# Altium schematic sheet LM5177_PINOUT.SchDoc
size C; SheetNumber: 16; SheetTotal: 19
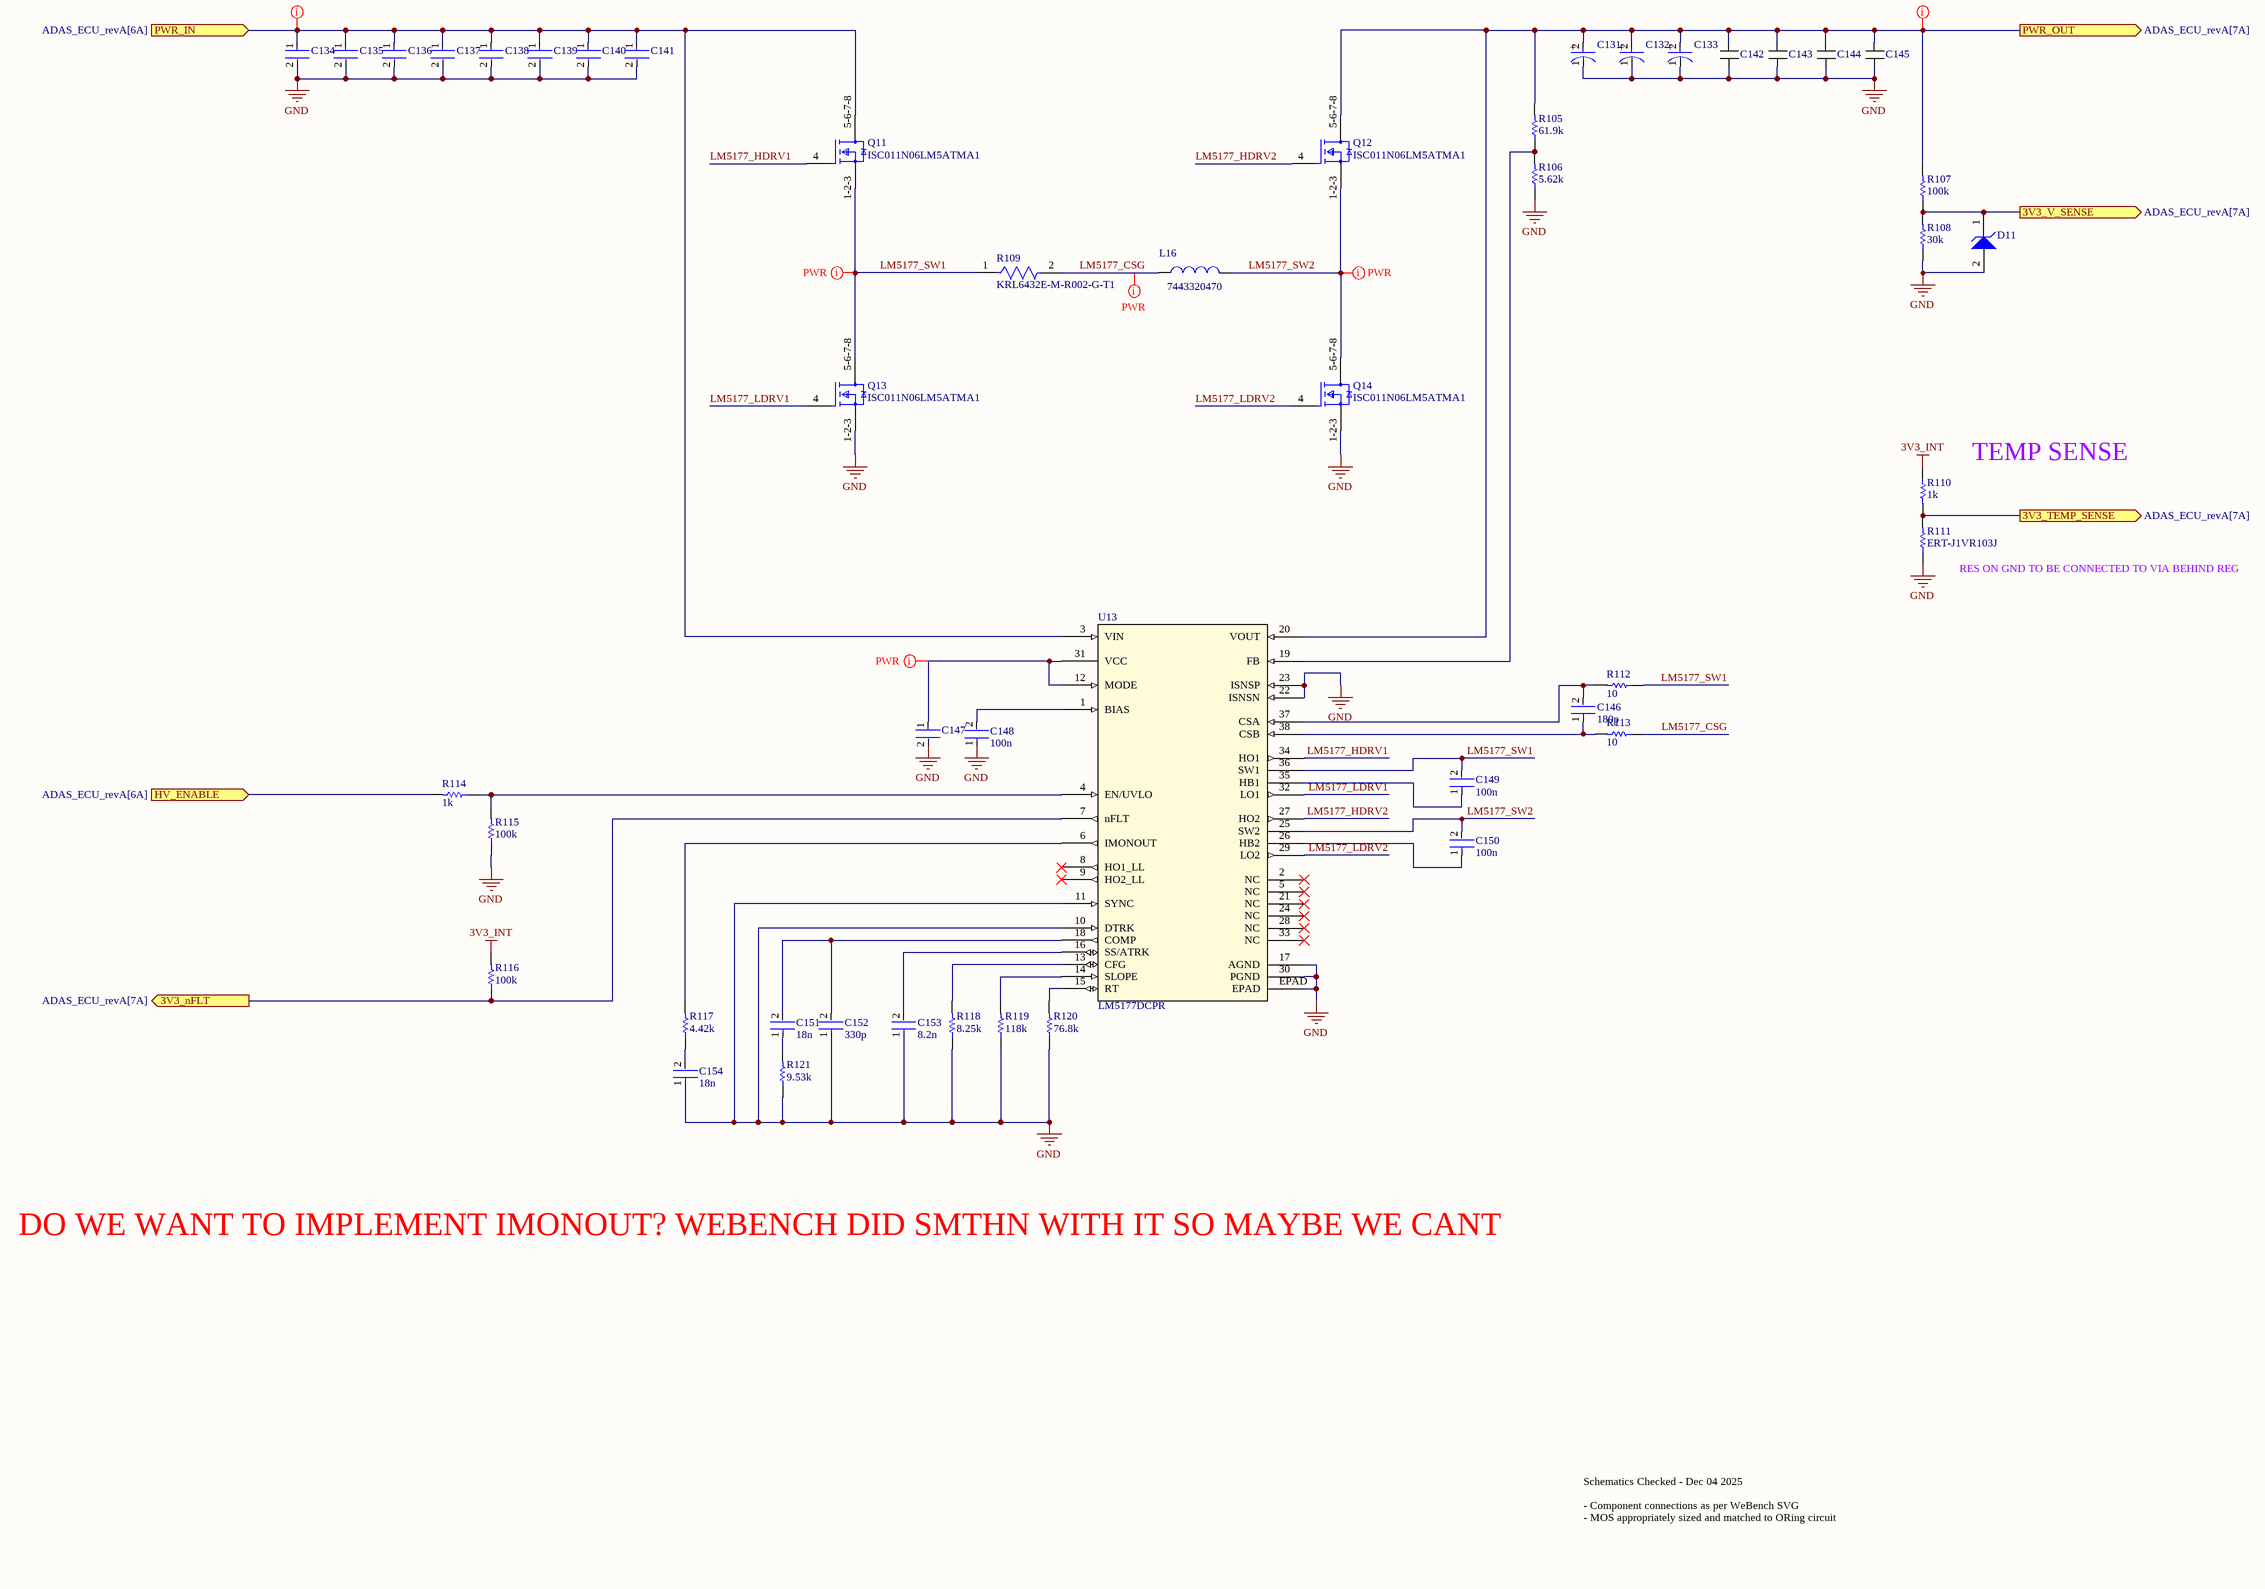
[diagram p0: LM5177_PINOUT.SchDoc]

## Parts
C131  20SVPF120M  [FP-OS-CON-SMT-C6-MFG]  (value not drawn)
C132  20SVPF120M  [FP-OS-CON-SMT-C6-MFG]  (value not drawn)
C133  20SVPF120M  [FP-OS-CON-SMT-C6-MFG]  (value not drawn)
C134  C3225X7R1H106M250AC  [FP-C3225-250-0_4-MFG]  (value not drawn)
C135  C3225X7R1H106M250AC  [FP-C3225-250-0_4-MFG]  (value not drawn)
C136  C3225X7R1H106M250AC  [FP-C3225-250-0_4-MFG]  (value not drawn)
C137  C3225X7R1H106M250AC  [FP-C3225-250-0_4-MFG]  (value not drawn)
C138  C3225X7R1H106M250AC  [FP-C3225-250-0_4-MFG]  (value not drawn)
C139  C3225X7R1H106M250AC  [FP-C3225-250-0_4-MFG]  (value not drawn)
C140  C3225X7R1H106M250AC  [FP-C3225-250-0_4-MFG]  (value not drawn)
C141  C3225X7R1H106M250AC  [FP-C3225-250-0_4-MFG]  (value not drawn)
C142  CGA9P2X7R1E226M250KA  [CGA9P2X7R1E226M250KA-Footprint-1]  (value not drawn)
C143  CGA9P2X7R1E226M250KA  [CGA9P2X7R1E226M250KA-Footprint-1]  (value not drawn)
C144  CGA9P2X7R1E226M250KA  [CGA9P2X7R1E226M250KA-Footprint-1]  (value not drawn)
C145  CGA9P2X7R1E226M250KA  [CGA9P2X7R1E226M250KA-Footprint-1]  (value not drawn)
C146  180p  [FP-0402-L_1_0_0_05-W_0_5-IPC_A]
C147  GRM188R60J226MEA0D  [FP-GRM188-0_1-e0_2_0_5-MFG]  (value not drawn)
C148  100n  [FP-0402-L_1_0_0_05-W_0_5-IPC_A]
C149  100n  [FP-0402-L_1_0_0_05-W_0_5-IPC_A]
C150  100n  [FP-0402-L_1_0_0_05-W_0_5-IPC_A]
C151  18n  [FP-0402-L_1_0_0_05-W_0_5-IPC_A]
C152  330p  [FP-0402-L_1_0_0_05-W_0_5-IPC_A]
C153  8.2n  [FP-0402-L_1_0_0_05-W_0_5-IPC_A]
C154  18n  [FP-0402-L_1_0_0_05-W_0_5-IPC_A]
D11  MM5Z3V3T1G  [ONSC-SOD-523-2-502-01_V]  (value not drawn)
L16  7443320470  [WE-HCC_1210]
Q11  ISC011N06LM5ATMA1  [FP-PG-TDSON-8-MFG]
Q12  ISC011N06LM5ATMA1  [FP-PG-TDSON-8-MFG]
Q13  ISC011N06LM5ATMA1  [FP-PG-TDSON-8-MFG]
Q14  ISC011N06LM5ATMA1  [FP-PG-TDSON-8-MFG]
R105  61.9k  [R0603B]
R106  5.62k  [R0603B]
R107  100k  [R0603B]
R108  30k  [R0603B]
R109  KRL6432E-M-R002-G-T1  [FP-KRL6432E-MFG]
R110  1k  [R0603B]
R111  ERT-J1VR103J  [RESC1608X90X30ML15T20]
R112  10  [R0603B]
R113  10  [R0603B]
R114  1k  [R0603B]
R115  100k  [R0603B]
R116  100k  [R0603B]
R117  4.42k  [R0603B]
R118  8.25k  [R0603B]
R119  118k  [R0603B]
R120  76.8k  [R0603B]
R121  9.53k  [R0603B]
U13  LM5177DCPR  [LM5177DCPR-Footprint-1]

## Ports
3V3_nFLT (out, see ADAS_ECU_revA[7A]), 3V3_TEMP_SENSE (out, see ADAS_ECU_revA[7A]), 3V3_V_SENSE (out, see ADAS_ECU_revA[7A]), HV_ENABLE (in, see ADAS_ECU_revA[6A]), PWR_IN (in, see ADAS_ECU_revA[6A]), PWR_OUT (out, see ADAS_ECU_revA[7A])

## Nets
3V3_INT: R110.1 R116.2
GND: C131.1(C) C132.1(C) C133.1(C) C134.2 C135.2 C136.2 C137.2 C138.2 C139.2 C140.2 C141.2 C142.2 C143.2 C144.2 C145.2 C147.2 C148.1 C152.1 C153.1 C154.1 D11.2(A) Q13.1-2-3(S) Q14.1-2-3(S) R106.1 R108.1 R111.1 R115.1 R118.1 R119.1 R120.1 R121.1 U13.10(DTRK) U13.11(SYNC) U13.17(AGND) U13.22(ISNSN) U13.23(ISNSP) U13.30(PGND) U13.EPAD
3V3_nFLT: R116.1 U13.7(nFLT) ; port 3V3_nFLT
3V3_TEMP_SENSE: R110.2 R111.2 ; port 3V3_TEMP_SENSE
3V3_V_SENSE: D11.1(K) R107.1 R108.2 ; port 3V3_V_SENSE
HV_ENABLE: R114.2 ; port HV_ENABLE
LM5177_CSG: L16.1 R109.2 R113.1
LM5177_HDRV1: Q11.4(G) U13.34(HO1)
LM5177_HDRV2: Q12.4(G) U13.27(HO2)
LM5177_LDRV1: Q13.4(G) U13.32(LO1)
LM5177_LDRV2: Q14.4(G) U13.29(LO2)
LM5177_SW1: C149.2 Q11.1-2-3(S) Q13.5-6-7-8(D) R109.1 R112.1 U13.36(SW1)
LM5177_SW2: C150.2 L16.2 Q12.1-2-3(S) Q14.5-6-7-8(D) U13.25(SW2)
PWR_IN: C134.1 C135.1 C136.1 C137.1 C138.1 C139.1 C140.1 C141.1 Q11.5-6-7-8(D) U13.3(VIN) ; port PWR_IN
PWR_OUT: C131.2(A) C132.2(A) C133.2(A) C142.1 C143.1 C144.1 C145.1 Q12.5-6-7-8(D) R105.2 R107.2 U13.20(VOUT) ; port PWR_OUT
NetC146_1: C146.1 R113.2 U13.38(CSB)
NetC146_2: C146.2 R112.2 U13.37(CSA)
NetC147_1: C147.1 U13.12(MODE) U13.31(VCC)
NetC148_2: C148.2 U13.1(BIAS)
NetC149_1: C149.1 U13.35(HB1)
NetC150_1: C150.1 U13.26(HB2)
NetC151_1: C151.1 R121.2
NetC151_2: C151.2 C152.2 U13.18(COMP)
NetC153_2: C153.2 U13.16(SS/ATRK)
NetC154_2: C154.2 R117.1
NetR105_1: R105.1 R106.2 U13.19(FB)
NetR114_1: R114.1 R115.2 U13.4(EN/UVLO)
NetR117_2: R117.2 U13.6(IMONOUT)
NetR118_2: R118.2 U13.13(CFG)
NetR119_2: R119.2 U13.14(SLOPE)
NetR120_2: R120.2 U13.15(RT)

Not connected (* = marked no-connect by the designer): U13 2(NC)* 5(NC)* 8(HO1_LL)* 9(HO2_LL)* 21(NC)* 24(NC)* 28(NC)* 33(NC)*

## Layout directives
net class PWR: LM5177_CSG, LM5177_SW1, LM5177_SW2, NetC147_1, PWR_IN, PWR_OUT

## Notes on the sheet
- TEMP SENSE
- (near R111) RES ON GND TO BE CONNECTED TO VIA BEHIND REG
- DO WE WANT TO IMPLEMENT IMONOUT? WEBENCH DID SMTHN WITH IT SO MAYBE WE CANT
- Schematics Checked - Dec 04 2025
  - Component connections as per WeBench SVG
  - MOS appropriately sized and matched to ORing circuit
- (in symbol CMP-05428-001333-1) +

## Library data of the parts
C131-C133 = CMP-05428-001333-1: Conductive Polymer Aluminum Solid Capacitors (OS-CON) 120uF ±20% 20V; Polarity: Polar; ESR (Equivalent Series Resistance): 25mR; Leakage Current: 480uA; Ripple Current: 3.2A; Life (Hours): 5000Hour; Dissipation Factor: 12%; Lead Free: Lead Free; Voltage Rating: 20V; Packaging: Tape and Reel; Min Operating Temperature: -55°C; Tolerance: 20%; Diameter: 6.3mm; Max Operating Temperature: 105°C; Length: 5.9mm; Termination: SMD/SMT; Height - Seated (Max): 0.236inch; REACH SVHC: No SVHC; Voltage Rating (DC): 20V; Voltage: 20V; Material: Polymer; Ripple Current (AC): 3.2A; Series: OS-CON™, SVPF; RoHS Compliant: Yes; Mount: Surface Mount; Height: 5.9mm; Package Quantity: 1000; Radiation Hardening: No; Construction: Cylindrical; Case/Package: Radial; Capacitance: 120uF; Number of Pins: 6
C134-C141 = CMP-08246-002653-1: Multilayer Ceramic Capacitors 10uF ±20% 50V X7R SMD 1210; Width: 0.098inch; Package Quantity: 1000; Height: 2.5mm; Dielectric Material: Ceramic; Voltage Rating: 50V; Series: C; Capacitance: 10uF; Tolerance: 20%; Weight: 0.000564oz; Case/Package: 1210; Case Code (Imperial): 1210; Dielectric: X7R; Case Code (Metric): 3225; REACH SVHC: No SVHC; Packaging: Tape and Reel; Length: 0.126inch; Termination: SMD/SMT; Min Operating Temperature: -55°C; Voltage Rating (DC): 50V; Lead Free: Lead Free; Max Operating Temperature: 125°C; Thickness: 0.11inch; Mount: Surface Mount
C142-C145 = CMP-001-00071-1: 25V 22uF X7R 卤20% 2220 Multilayer Ceramic Capacitors MLCC - SMD/SMT ROHS; Tolerance: 20%; Value: 22µF; Mounting Technology: Surface Mount; Voltage Rating: 25V; Min Operating Temperature: -55°C; Case/Package: 2220; Max Operating Temperature: 125°C
C146 C148-C154 = CMP-001-00058-1: LARGE PADS, 0402 CAP, CHANGE COMMENT TO MATCH REAL P/N; Capacitor Type: Ceramic; Min Operating Temperature: -55°C; Mounting Technology: Surface Mount; Pins: 2; Case/Package: 0402; RoHS Compliant: Yes; Max Operating Temperature: 85°C
C147 = CMP-2006-02836-2: 22uF cap, diff pn; Voltage: 10V; Dielectric: X7R; Material: Ceramic; Capacitance: 2.2uF; Tolerance: 10%; Case Code (Metric): 1608; Height: 0.8mm; Packaging: Cut Tape; Lead Free: Lead Free; Min Operating Temperature: -55°C; Voltage Rating (DC): 10V; Max Operating Temperature: 125°C; Voltage Rating: 10V; Depth: 0.8mm; Case Code (Imperial): 0603; Termination: SMD/SMT; Case/Package: 0603; Number of Pins: 2; REACH SVHC: No SVHC; Mount: Surface Mount; Width: 0.031inch; Package Quantity: 1; Weight: 7.1E-05oz; Length: 1.6mm; Thickness: 0.035inch
D11 = CMP-1060-00750-1: Zener Voltage Regulator, 500 mW, 2-Pin SOD-523, Pb-Free, Tape and Reel; Manufacturer: On Semiconductor; P Max (W): 0.5; VZ Typ (V): 3.3; RoHS: Pb-Free; ComponentLink2Description: Datasheet; PackageReference: SOD-523-2-502-01; DatasheetVersion: Rev. 10; ComponentLink1Description: Manufacturer URL; PackageVersion: Rev. E, 09/2010; ComponentLink3URL: http://www.onsemi.com/pub_link/Collateral/502-01.PDF; ComponentLink2URL: http://www.onsemi.cn/pub_link/Collateral/MM5Z2V4T1-D.PDF; Mounting Technology: Surface Mount; PartNumber: MM5Z3V3T1G; Packing: Tape and Reel; PackageDescription: 2-Pin SOD, Body 1.2 x 0.8 mm; ComponentLink1URL: http://www.onsemi.com/; ComponentLink3Description: Package Specification
L16 = CMP-0226-00121-3: We-hcc Series, Shielded Wire-wound SMD Inductor With Ferrite Core, 4.7 Uh; Inductance Tolerance: 20%; Self Resonant Frequency: 43MHz; Saturation Current: 15.6A; Current Rating: 15.5A; Inductance: 4.7µH; DC Resistance (DCR): 7.25mΩ; Width: 11.4mm; Core Material: Ferrite; Number of Pins: 2; Material: Ferrite; RoHS: Compliant; Length: 12.1mm; Max Operating Temperature: 125°C; Ambient Temperature Range Low: -40°C; Min Operating Temperature: -40°C; Height: 9.5mm; Ambient Temperature Range High: 75°C
Q11-Q14 = CMP-32901-001049-1: TRENCH 40<-<100V PG-TDSON-8
R105-R108 R110 R112-R121 = CMP-009-00002-14: Resistor
  R110: Value: 1k
R109 = CMP-00597-24927455-1: KRL6432E-M-R002-G-T1 Metal Foil Low Resistance Chip Resistor (long-side terminal), 2512, RoHS; Power Rating: 3W; Tolerance: 2%; Resistance: 2mΩ; Temperature Coefficient: 100ppm/°C; Width: 6.3mm; Termination: SMD/SMT; Weight: 40.511469mg; RoHS: Compliant; Lifecycle Status: Production; Case Code (Imperial): 2512; Case Code (Metric): 6432; Case/Package: 2512; Height: 700µm; Length: 3.1mm; Max Thickness: 700µm; Min Operating Temperature: -55°C; NexarPartId: 24927455; Composition: Metal Foil; Max Operating Temperature: 155°C
R111 = CMP-2000-00869-1: Manufacturer: Panasonic; Part Number: ERT-J1VR103J
U13 = CMP-019-00059-2: IC Buck-Boost Regulator Positive Output Step-Up/Step-Down DC-DC Controller IC 38-HTSSOP; Pins: 38